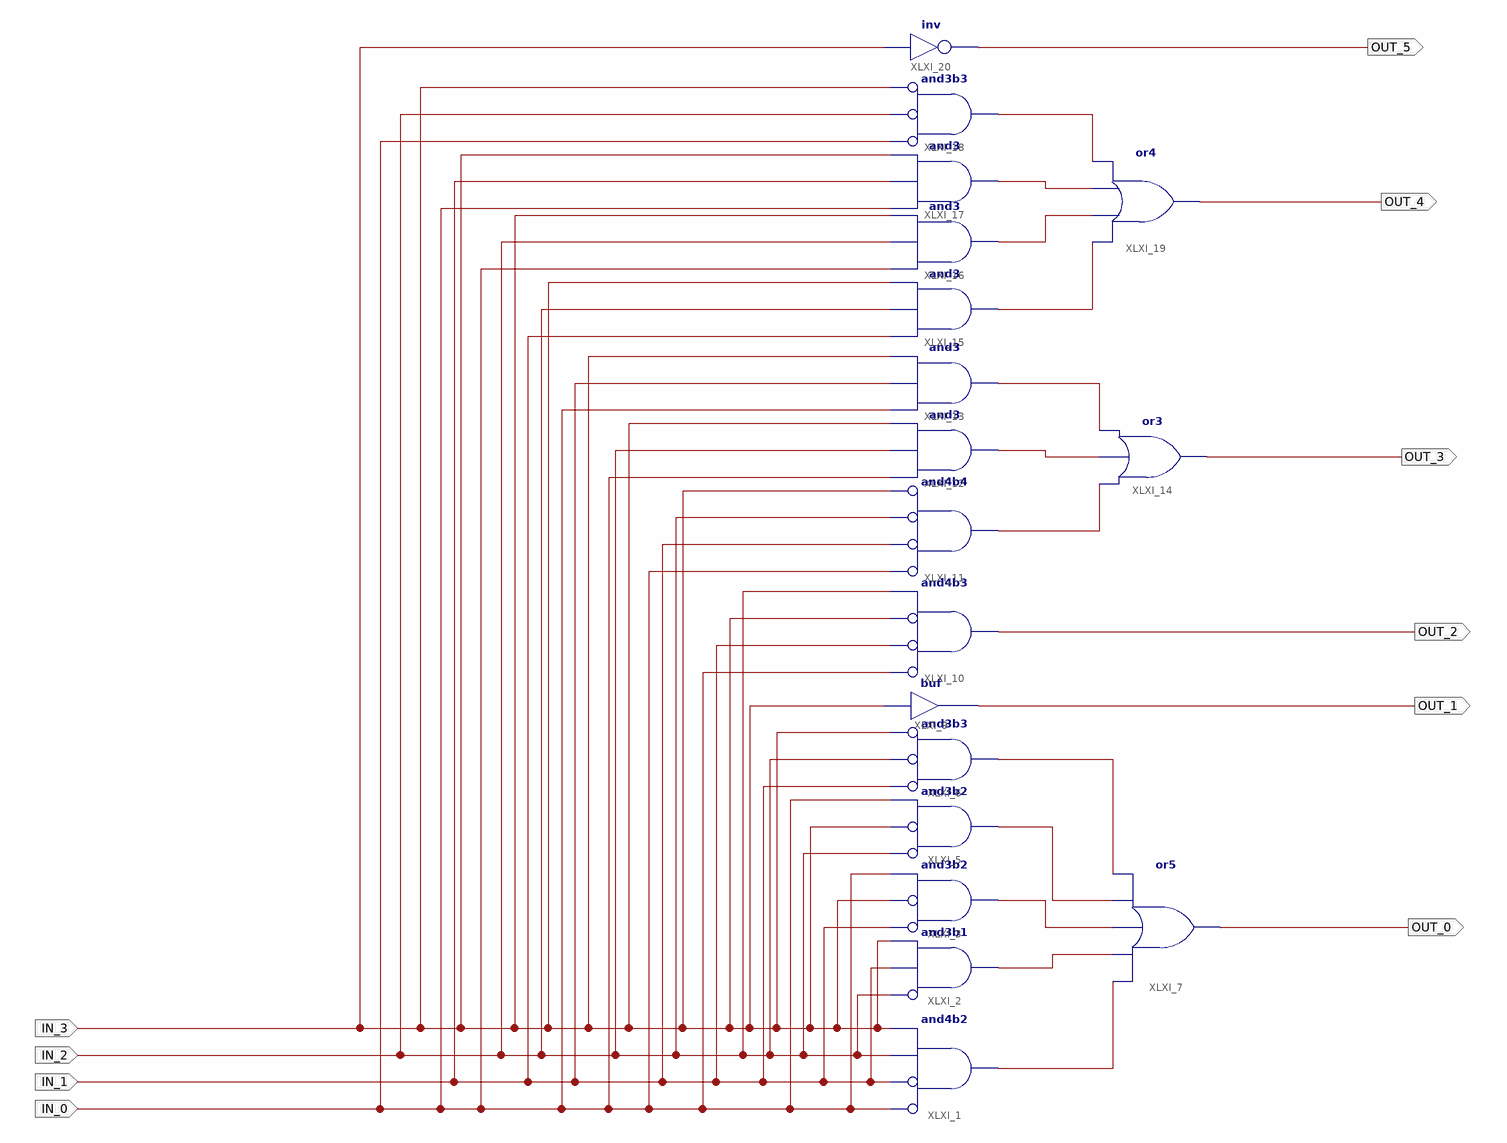
[diagram p0: schematic sheet 1]
// Xilinx ISE schematic schema.sch (spartan3a) as structural Verilog: 18 symbols, 10 ports
module schema (
  input  IN_3,
  input  IN_2,
  input  IN_1,
  input  IN_0,
  output OUT_0,
  output OUT_1,
  output OUT_2,
  output OUT_3,
  output OUT_4,
  output OUT_5
);

  wire XLXN_1, XLXN_2, XLXN_3, XLXN_4, XLXN_5, XLXN_30, XLXN_31, XLXN_32, XLXN_45, XLXN_46, XLXN_47, XLXN_48;

  and XLXI_1 (XLXN_5, ~IN_0, ~IN_1, IN_2, IN_3);  // and4b2
  and XLXI_2 (XLXN_4, ~IN_2, IN_1, IN_3);  // and3b1
  and XLXI_3 (XLXN_3, ~IN_1, ~IN_3, IN_0);  // and3b2
  and XLXI_5 (XLXN_2, ~IN_2, ~IN_3, IN_0);  // and3b2
  and XLXI_6 (XLXN_1, ~IN_1, ~IN_2, ~IN_3);  // and3b3
  or XLXI_7 (OUT_0, XLXN_5, XLXN_4, XLXN_3, XLXN_2, XLXN_1);
  buf XLXI_9 (OUT_1, IN_3);
  and XLXI_10 (OUT_2, ~IN_0, ~IN_1, ~IN_3, IN_2);  // and4b3
  and XLXI_11 (XLXN_32, ~IN_0, ~IN_1, ~IN_2, ~IN_3);  // and4b4
  and XLXI_12 (XLXN_31, IN_0, IN_2, IN_3);
  and XLXI_13 (XLXN_30, IN_0, IN_1, IN_3);
  or XLXI_14 (OUT_3, XLXN_32, XLXN_31, XLXN_30);
  and XLXI_15 (XLXN_48, IN_1, IN_2, IN_3);
  and XLXI_16 (XLXN_47, IN_0, IN_2, IN_3);
  and XLXI_17 (XLXN_46, IN_0, IN_1, IN_3);
  and XLXI_18 (XLXN_45, ~IN_0, ~IN_2, ~IN_3);  // and3b3
  or XLXI_19 (OUT_4, XLXN_48, XLXN_47, XLXN_46, XLXN_45);
  not XLXI_20 (OUT_5, IN_3);
endmodule
